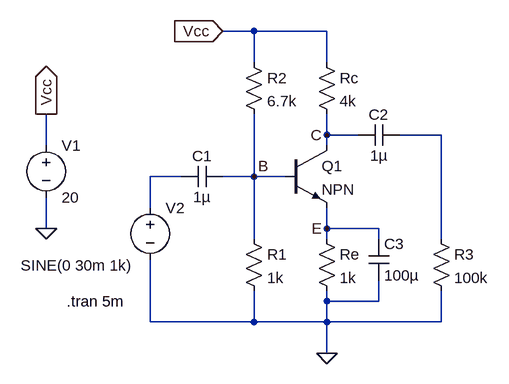
[diagram p0: schematic Amp_Class_A.asc]
Amp_Class_A.asc, the LTspice schematic file:
Version 4
SHEET 1 880 680
WIRE 128 -80 80 -80
WIRE 240 -80 128 -80
WIRE 128 -32 128 -80
WIRE 240 -32 240 -80
WIRE 240 80 240 48
WIRE 288 80 240 80
WIRE 416 80 352 80
WIRE -192 96 -192 48
WIRE 240 96 240 80
WIRE 16 144 -32 144
WIRE 128 144 128 48
WIRE 128 144 80 144
WIRE 176 144 128 144
WIRE -32 192 -32 144
WIRE -192 224 -192 176
WIRE 240 224 240 192
WIRE 320 224 240 224
WIRE 128 240 128 144
WIRE 240 240 240 224
WIRE 320 240 320 224
WIRE 416 240 416 80
WIRE 240 336 240 320
WIRE 320 336 320 304
WIRE 320 336 240 336
WIRE -32 368 -32 272
WIRE 128 368 128 320
WIRE 128 368 -32 368
WIRE 240 368 240 336
WIRE 240 368 128 368
WIRE 416 368 416 320
WIRE 416 368 240 368
WIRE 240 416 240 368
FLAG -192 224 0
FLAG 80 -80 Vcc
IOPIN 80 -80 In
FLAG -192 48 Vcc
IOPIN -192 48 Out
FLAG 240 416 0
FLAG 240 80 C
FLAG 240 224 E
FLAG 128 144 B
SYMBOL npn 176 96 R0
SYMATTR InstName Q1
SYMBOL res 112 224 R0
SYMATTR InstName R1
SYMATTR Value 1k
SYMBOL res 112 -48 R0
SYMATTR InstName R2
SYMATTR Value 6.7k
SYMBOL res 224 -48 R0
SYMATTR InstName Rc
SYMATTR Value 4k
SYMBOL res 224 224 R0
SYMATTR InstName Re
SYMATTR Value 1k
SYMBOL voltage -192 80 R0
WINDOW 123 0 0 Left 0
WINDOW 39 0 0 Left 0
SYMATTR InstName V1
SYMATTR Value 20
SYMBOL cap 80 128 R90
WINDOW 0 0 32 VBottom 2
WINDOW 3 32 32 VTop 2
SYMATTR InstName C1
SYMATTR Value 1µ
SYMBOL cap 352 64 R90
WINDOW 0 0 32 VBottom 2
WINDOW 3 32 32 VTop 2
SYMATTR InstName C2
SYMATTR Value 1µ
SYMBOL res 400 224 R0
SYMATTR InstName R3
SYMATTR Value 100k
SYMBOL voltage -32 176 R0
WINDOW 3 -199 105 Left 2
WINDOW 123 0 0 Left 0
WINDOW 39 0 0 Left 0
SYMATTR InstName V2
SYMATTR Value SINE(0 30m 1k)
SYMBOL cap 304 240 R0
SYMATTR InstName C3
SYMATTR Value 100µ
TEXT -160 336 Left 2 !.tran 5m

The netlist it stands for:
* Amp_Class_A.asc
Q1 C B E 0 NPN
R1 B 0 1k
R2 Vcc B 6.7k
Rc Vcc C 4k
Re E 0 1k
V1 Vcc 0 20
C1 B N002 1µ
C2 N001 C 1µ
R3 N001 0 100k
V2 N002 0 SINE(0 30m 1k)
C3 E 0 100µ
.model NPN NPN
.model PNP PNP
.lib standard.bjt
.tran 5m
.backanno
.end